# Altium schematic sheet Python_Auxiliary.SchDoc
size A
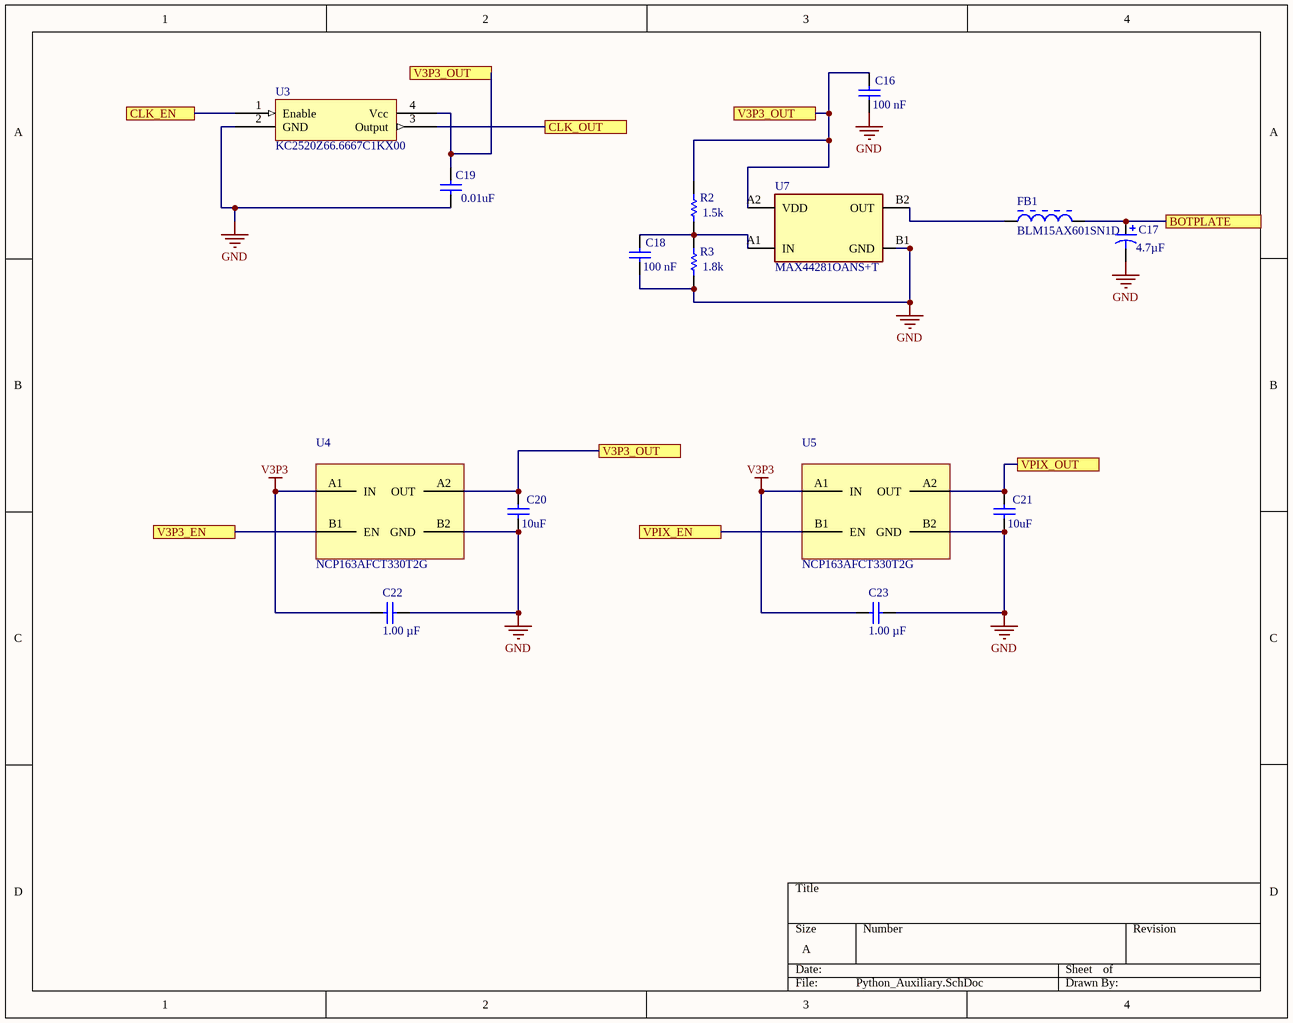
[diagram p0: Python_Auxiliary.SchDoc]

## Parts
C16  Capacitance: 100 nF  [PCB-v6eq6etc9p7u7qdkgnno-1]  (hidden comment: GRM033C71C104KE14D)
C17  Capacitance: 4.7µF  [PCB-t0dwbiosd2m6unyihqym-1]  (hidden comment: F981A475MUALZT)
C18  Capacitance: 100 nF  [PCB-v6eq6etc9p7u7qdkgnno-1]  (hidden comment: GRM033C71C104KE14D)
C19  Capacitance: 0.01uF  [PCB-v6eq6etc9p7u7qdkgnno-1]  (hidden comment: GRM033R71A103KA01D)
C20  Capacitance: 10uF  [PCB-uspfzztrpe7hn2xlyjz9-1]  (hidden comment: GRM155R61A106ME11D)
C21  Capacitance: 10uF  [PCB-uspfzztrpe7hn2xlyjz9-1]  (hidden comment: GRM155R61A106ME11D)
C22  Capacitance: 1.00 µF  [PCB-v6eq6etc9p7u7qdkgnno-1]  (hidden comment: GRM033R60J105MEA2D)
C23  Capacitance: 1.00 µF  [PCB-v6eq6etc9p7u7qdkgnno-1]  (hidden comment: GRM033R60J105MEA2D)
FB1  BLM15AX601SN1D  [MURA-BLM15-CHIP-2_V]
R2  Resistance: 1.5k  [PCB-7g93mzch2qc2q3jid3ok-1]  (hidden comment: ERA-1AEB152C)
R3  Resistance: 1.8k  [PCB-7g93mzch2qc2q3jid3ok-1]  (hidden comment: CRCW02011K80JNED)
U3  KC2520Z66.6667C1KX00  [ASD]
U4  NCP163AFCT330T2G  [PCB-ng8273kv6qqz2xsov2q1-1]
U5  NCP163AFCT330T2G  [PCB-ng8273kv6qqz2xsov2q1-1]
U7  MAX44281OANS+T  [FP-N40A0-1-MFG]

## Ports
BOTPLATE, CLK_EN, CLK_OUT, V3P3_EN, V3P3_OUT, VPIX_EN, VPIX_OUT

## Nets
GND: C16.1 C17.2 C18.1 C19.1 C20.2 C21.2 C22.1 C23.1 R3.1 U3.2(GND) U4.B2(GND) U5.B2(GND) U7.B1(GND)
V3P3: C22.2 C23.2 U4.A1(IN) U5.A1(IN)
BOTPLATE: C17.1 FB1.2 ; port BOTPLATE
CLK_EN: U3.1(Enable) ; port CLK_EN
CLK_OUT: U3.3(Output) ; port CLK_OUT
V3P3_EN: U4.B1(EN) ; port V3P3_EN
V3P3_OUT: C16.2 C19.2 C20.1 R2.2 U3.4(Vcc) U4.A2(OUT) U7.A2(VDD) ; port V3P3_OUT
VPIX_EN: U5.B1(EN) ; port VPIX_EN
VPIX_OUT: C21.1 U5.A2(OUT) ; port VPIX_OUT
NetC18_2: C18.2 R2.1 R3.2 U7.A1(IN)
NetFB1_1: FB1.1 U7.B2(OUT)

## Library data of the parts
C16 C18 = CMP-cc290632c88a13ee-3: 0.1 µF ±10% 16V Ceramic Capacitor X7S 0201 (0603 Metric); Lead-Free Status: Lead Free; Voltage Rating (DC): 16.0 V; Packaging: Reel; Dielectric Characteristic: X7S; OctopartID: cc290632c88a13ee; Size-Width: 300 µm; Manufacturer Part Number: GRM033C71C104KE14D; Case/Package: 0201; Capacitance Tolerance: ±10%; Size-Length: 600 µm; Octopart URL: http://octopart.com/grm033c71c104ke14d-murata-51454405; Mounting Style: Surface Mount; Size-Thickness: 300 µm; RoHS: Compliant
C17 = CMP-b7737c8c1b6d68b4-6: 4.7 µF Molded Tantalum Capacitors 10 V 0402 (1005 Metric) -; Voltage - Rated: 10V; OctopartID: b7737c8c1b6d68b4; Octopart URL: http://octopart.com/f981a475mualzt-avx-49645944; Packaging: Tape & Reel (TR)
C19 = CMP-19299660-4: 10000 pF ±10% 10V Ceramic Capacitor X7R 0201 (0603 Metric); Case/Package: 0201
C20 C21 = CMP-eacb22ede71a350c-8: 10 µF ±20% 10V Ceramic Capacitor X5R 0402 (1005 Metric)
C22 C23 = CMP-7dcab586fd61a20d-5: 1 µF ±20% 6.3V Ceramic Capacitor X5R 0201 (0603 Metric); Case/Package (SI): 0603; Dielectric Characteristic: X5R; Size-Length: 600 µm; OctopartID: 7dcab586fd61a20d
FB1 = CMP-886590-4: 600 Ohms @ 100 MHz 1 - Ferrite Bead 0402 (1005 Metric) 500mA 340mOhm; Lead-Free Status: Lead Free; Number of Circuits: 1; Resistance: 1000.0 Ω; Octopart Url: https://octopart.com/blm15ax102sn1d-murata-17749155; OctopartID: 6cdea4da9d1bb319; REACH SVHC Compliance: No SVHC; RoHS: Compliant; Size-Length: 0.001 m; Size-Width: 0.0005 m
R2 = CMP-1848326-4: 1.5 kOhms ±0.1% 0.05W, 1/20W Chip Resistor 0201 (0603 Metric) - Thin Film; Resistance Tolerance: ±5%; Size-Height: 0.00023 m
R3 = CMP-1848326-4: 1.8 kOhms ±5% 0.05W, 1/20W Chip Resistor 0201 (0603 Metric) - Thick Film; Resistance Tolerance: ±5%; Size-Height: 0.00023 m
U3 = ASD oscillator: 66.667 MHz XO (Standard) CMOS Oscillator 1.71V ~ 3.63V Standby (Power Down) 4-SMD, No Lead
U4 U5 = CMP-c6890ab21004194e-8: Linear Voltage Regulator IC Positive Fixed 1 Output 250mA 4-WLCSP (0.64x0.64)
U7 = CMP-05699-000060-1: General Purpose Amplifier 1 Circuit Rail-to-Rail 4-WLP (0.84x0.84); RoHS Compliant: Yes